# Altium project FSAEWheelDaughterboard.PrjPcb
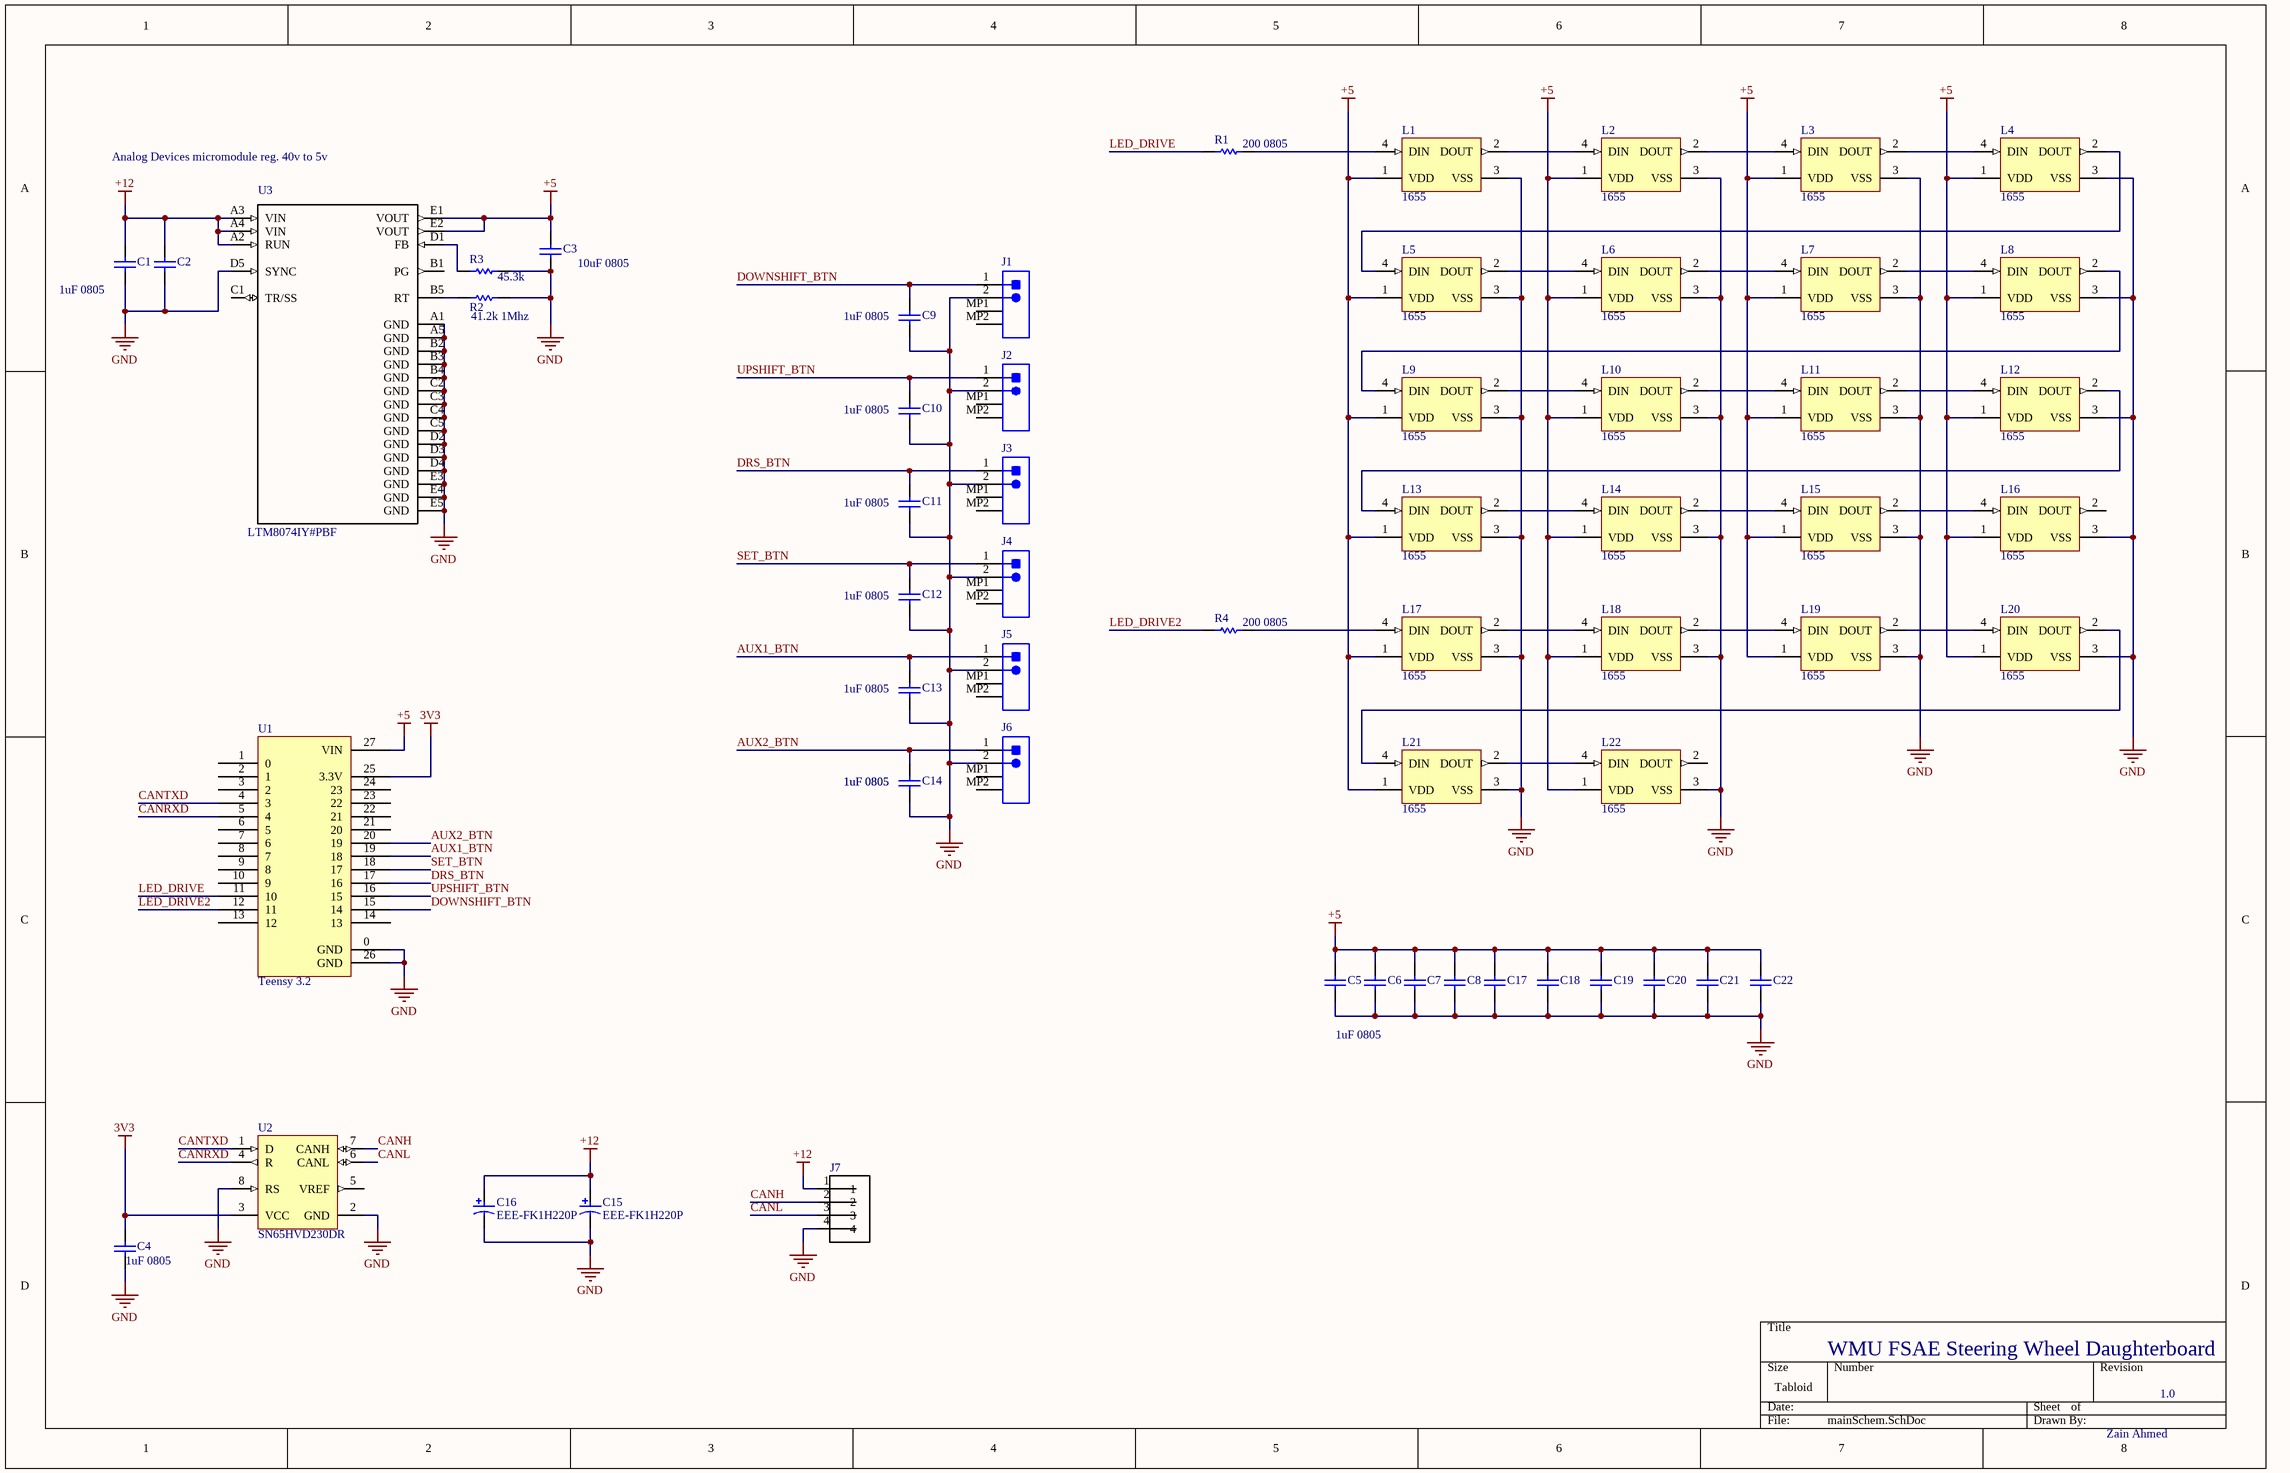
[diagram p0: mainSchem.SchDoc]
1 sheet, 58 parts. Net scope: global (net labels, ports and power ports of the same name join across sheets).
Board file: mainPCB.PcbDoc

## Sheet mainSchem.SchDoc
size Tabloid

### Parts
C1  GRM216R61E105KA12D  [CAPC2013X70X45NL10T25]  (value not drawn)
C2  GRM216R61E105KA12D  [CAPC2013X70X45NL10T25]  (value not drawn)
C3  GRM21BR61C106KE15L  [CAPC2013X135X50LL10T20]  (value not drawn)
C4  GRM216R61E105KA12D  [CAPC2013X70X45NL10T25]  (value not drawn)
C5  GRM216R61E105KA12D  [CAPC2013X70X45NL10T25]  (value not drawn)
C6  GRM216R61E105KA12D  [CAPC2013X70X45NL10T25]  (value not drawn)
C7  GRM216R61E105KA12D  [CAPC2013X70X45NL10T25]  (value not drawn)
C8  GRM216R61E105KA12D  [CAPC2013X70X45NL10T25]  (value not drawn)
C9  GRM216R61E105KA12D  [CAPC2013X70X45NL10T25]  (value not drawn)
C10  GRM216R61E105KA12D  [CAPC2013X70X45NL10T25]  (value not drawn)
C11  GRM216R61E105KA12D  [CAPC2013X70X45NL10T25]  (value not drawn)
C12  GRM216R61E105KA12D  [CAPC2013X70X45NL10T25]  (value not drawn)
C13  GRM216R61E105KA12D  [CAPC2013X70X45NL10T25]  (value not drawn)
C14  GRM216R61E105KA12D  [CAPC2013X70X45NL10T25]  (value not drawn)
C15  EEE-FK1H220P  [PNSC-EEE-FK1H220P_L]
C16  EEE-FK1H220P  [PNSC-EEE-FK1H220P_L]
C17  GRM216R61E105KA12D  [CAPC2013X70X45NL10T25]  (value not drawn)
C18  GRM216R61E105KA12D  [CAPC2013X70X45NL10T25]  (value not drawn)
C19  GRM216R61E105KA12D  [CAPC2013X70X45NL10T25]  (value not drawn)
C20  GRM216R61E105KA12D  [CAPC2013X70X45NL10T25]  (value not drawn)
C21  GRM216R61E105KA12D  [CAPC2013X70X45NL10T25]  (value not drawn)
C22  GRM216R61E105KA12D  [CAPC2013X70X45NL10T25]  (value not drawn)
J1  B2B-PH-SM4-TB(LF)(SN)  [JST-B2B-PH-SM4-TB-2_V]  (value not drawn)
J2  B2B-PH-SM4-TB(LF)(SN)  [JST-B2B-PH-SM4-TB-2_V]  (value not drawn)
J3  B2B-PH-SM4-TB(LF)(SN)  [JST-B2B-PH-SM4-TB-2_V]  (value not drawn)
J4  B2B-PH-SM4-TB(LF)(SN)  [JST-B2B-PH-SM4-TB-2_V]  (value not drawn)
J5  B2B-PH-SM4-TB(LF)(SN)  [JST-B2B-PH-SM4-TB-2_V]  (value not drawn)
J6  B2B-PH-SM4-TB(LF)(SN)  [JST-B2B-PH-SM4-TB-2_V]  (value not drawn)
J7  B4B-PH-SM4-TB  [*JST_B4B-PH-SM4-TB]  (value not drawn)
L1  1655  [ADA-RGB-1655_V]
L2  1655  [ADA-RGB-1655_V]
L3  1655  [ADA-RGB-1655_V]
L4  1655  [ADA-RGB-1655_V]
L5  1655  [ADA-RGB-1655_V]
L6  1655  [ADA-RGB-1655_V]
L7  1655  [ADA-RGB-1655_V]
L8  1655  [ADA-RGB-1655_V]
L9  1655  [ADA-RGB-1655_V]
L10  1655  [ADA-RGB-1655_V]
L11  1655  [ADA-RGB-1655_V]
L12  1655  [ADA-RGB-1655_V]
L13  1655  [ADA-RGB-1655_V]
L14  1655  [ADA-RGB-1655_V]
L15  1655  [ADA-RGB-1655_V]
L16  1655  [ADA-RGB-1655_V]
L17  1655  [ADA-RGB-1655_V]
L18  1655  [ADA-RGB-1655_V]
L19  1655  [ADA-RGB-1655_V]
L20  1655  [ADA-RGB-1655_V]
L21  1655  [ADA-RGB-1655_V]
L22  1655  [ADA-RGB-1655_V]
R1  ERA6AEB201V  [RESC2013X60X40NL20T25]  (value not drawn)
R2  ERJ-6ENF4122V  [RESC2013X70X40LL20T20]  (value not drawn)
R3  ERJ-6ENF4532V  [RESC2013X70X40ML20T20]  (value not drawn)
R4  ERA6AEB201V  [RESC2013X60X40NL20T25]  (value not drawn)
U1  Teensy 3.2  [Teensy3_2]
U2  SN65HVD230DR  [D0008A_L]
U3  LTM8074IY#PBF  [*BGA25C65P5X5_400X400X198N_LTM8074IY#PBF(Primary)]

### Nets
3V3: C4.1 U1.25(3.3V) U2.3(VCC)
+5: C3.1 C5.1 C6.1 C7.1 C8.1 C17.1 C18.1 C19.1 C20.1 C21.1 C22.1 L1.1(VDD) L2.1(VDD) L3.1(VDD) L4.1(VDD) L5.1(VDD) L6.1(VDD) L7.1(VDD) L8.1(VDD) L9.1(VDD) L10.1(VDD) L11.1(VDD) L12.1(VDD) L13.1(VDD) L14.1(VDD) L15.1(VDD) L16.1(VDD) L17.1(VDD) L18.1(VDD) L19.1(VDD) L20.1(VDD) L21.1(VDD) L22.1(VDD) U1.27(VIN) U3.E1(VOUT) U3.E2(VOUT)
+12: C1.1 C2.1 C15.1 C16.1 J7.1 U3.A2(RUN) U3.A3(VIN) U3.A4(VIN)
GND: C1.2 C2.2 C3.2 C4.2 C5.2 C6.2 C7.2 C8.2 C9.2 C10.2 C11.2 C12.2 C13.2 C14.2 C15.2 C16.2 C17.2 C18.2 C19.2 C20.2 C21.2 C22.2 J1.2 J2.2 J3.2 J4.2 J5.2 J6.2 J7.4 L1.3(VSS) L2.3(VSS) L3.3(VSS) L4.3(VSS) L5.3(VSS) L6.3(VSS) L7.3(VSS) L8.3(VSS) L9.3(VSS) L10.3(VSS) L11.3(VSS) L12.3(VSS) L13.3(VSS) L14.3(VSS) L15.3(VSS) L16.3(VSS) L17.3(VSS) L18.3(VSS) L19.3(VSS) L20.3(VSS) L21.3(VSS) L22.3(VSS) R2.2 R3.2 U1.0(GND) U1.26(GND) U2.2(GND) U2.8(RS) U3.A1(GND) U3.A5(GND) U3.B2(GND) U3.B3(GND) U3.B4(GND) U3.C2(GND) U3.C3(GND) U3.C4(GND) U3.C5(GND) U3.D2(GND) U3.D3(GND) U3.D4(GND) U3.D5(SYNC) U3.E3(GND) U3.E4(GND) U3.E5(GND)
AUX1_BTN: C13.1 J5.1 U1.19(18)
AUX2_BTN: C14.1 J6.1 U1.20(19)
CANH: J7.2 U2.7(CANH)
CANL: J7.3 U2.6(CANL)
CANRXD: U1.5(4) U2.4(R)
CANTXD: U1.4(3) U2.1(D)
DOWNSHIFT_BTN: C9.1 J1.1 U1.15(14)
DRS_BTN: C11.1 J3.1 U1.17(16)
LED_DRIVE: R1.1 U1.11(10)
LED_DRIVE2: R4.1 U1.12(11)
SET_BTN: C12.1 J4.1 U1.18(17)
UPSHIFT_BTN: C10.1 J2.1 U1.16(15)
NetL1_2: L1.2(DOUT) L2.4(DIN)
NetL1_4: L1.4(DIN) R1.2
NetL2_2: L2.2(DOUT) L3.4(DIN)
NetL3_2: L3.2(DOUT) L4.4(DIN)
NetL4_2: L4.2(DOUT) L5.4(DIN)
NetL5_2: L5.2(DOUT) L6.4(DIN)
NetL6_2: L6.2(DOUT) L7.4(DIN)
NetL7_2: L7.2(DOUT) L8.4(DIN)
NetL8_2: L8.2(DOUT) L9.4(DIN)
NetL9_2: L9.2(DOUT) L10.4(DIN)
NetL10_2: L10.2(DOUT) L11.4(DIN)
NetL11_2: L11.2(DOUT) L12.4(DIN)
NetL12_2: L12.2(DOUT) L13.4(DIN)
NetL13_2: L13.2(DOUT) L14.4(DIN)
NetL14_2: L14.2(DOUT) L15.4(DIN)
NetL15_2: L15.2(DOUT) L16.4(DIN)
NetL17_2: L17.2(DOUT) L18.4(DIN)
NetL17_4: L17.4(DIN) R4.2
NetL18_2: L18.2(DOUT) L19.4(DIN)
NetL19_2: L19.2(DOUT) L20.4(DIN)
NetL20_2: L20.2(DOUT) L21.4(DIN)
NetL21_2: L21.2(DOUT) L22.4(DIN)
NetR2_1: R2.1 U3.B5(RT)
NetR3_1: R3.1 U3.D1(FB)

Not connected (* = marked no-connect by the designer): J1 MP1 MP2; J2 MP1 MP2; J3 MP1 MP2; J4 MP1 MP2; J5 MP1 MP2; J6 MP1 MP2; L16 2(DOUT); L22 2(DOUT); U1 1(0) 2(1) 3(2) 6(5) 7(6) 8(7) 9(8) 10(9) 13(12) 14(13) 21(20) 22(21) 23(22) 24(23); U2 5(VREF); U3 B1(PG) C1(TR/SS)

### Notes on the sheet
- Analog Devices micromodule reg. 40v to 5v
- (near R1) 200 0805
- (near C1) 1uF 0805
- (near R3) 45.3k
- (near C3) 10uF 0805
- (near R2) 41.2k 1Mhz
- (near C9) 1uF 0805
- (near C10) 1uF 0805
- (near C11) 1uF 0805
- (near C12) 1uF 0805
- (near R4) 200 0805
- (near C13) 1uF 0805
- (near C14) 1uF 0805
- 1uF 0805
- (near C4) 1uF 0805
- WMU FSAE Steering Wheel Daughterboard
- 1.0
- Zain Ahmed

### Library data of the parts
C1 C2 C4-C14 C17-C22 = CMP-2007-00957-1: Manufacturer: Murata; Part Number: GRM216R61E105KA12D
C3 = CMP-2007-03453-1: Manufacturer: Murata; Part Number: GRM21BR61C106KE15L
C15 C16 = CMP-2000-06209-1: Cap Aluminum Lytic, 22 uF, +/- 20%, 6.3 to 100 V, -55 to 105 degC, 2-Pin SMD, RoHS, Tape and Reel; Manufacturer: Panasonic; Capacitance: 22µF; Rated Voltage: 50V; Lifetime@Temperature: 2000Hrs@105°C; Ripple Current: 165mA; Impedance: 0.88O; Type: Can; Operating Temp Range: -55to+105°C; Package Reference: EEE-FK1H220P; Case Size/Dimension: Ø6.3x5.8mm; Manufacturer URL: http://www.panasonic.com/; Datasheet URL: http://www.mouser.com/ds/2/315/ABA0000CE120-68386.pdf; Mounting Technology: SurfaceMount; Datasheet Version: 03/2014; Package Description: 2-Pin Aluminum Electrolytic Capacitor, Base 6.6 x 6.6 mm, Height 6.10 mm; Operating Temp-Max: 105°C; Series: FK
J1-J6 = CMP-2000-05163-1: Male Header, Pitch 2 mm, 1 x 2 Position, Height 6.6 mm, RoHS, Tape and Reel; Manufacturer: JST; No of Positions: 2; Style/Orientation: StraightHeader/Plug; Pitch: 2mm; Datasheet URL: https://ciiva.com/datasheet-click-26894756?src=ciiva&sig=90099765; Termination: Crimp; Manufacturer URL: http://www.jst.com/home2.html; Type: ShroudedHeader; Datasheet Version: Dec-12
J7 = B4B-PH-SM4-TB: Connector Header Surface Mount 4 position 0.079 _2.00mm_; MF: JST Sales; SnapEDA_Link: https://www.snapeda.com/parts/B4B-PH-SM4-TB/JST%20Sales%20America%20Inc./view-part/48901/?ref=snap; Availability: Unavailable; Package: None; Price: None; MP: B4B-PH-SM4-TB; Value: *
L1-L22 = CMP-2000-05026-1: Intelligent Control LED Integrated Light Source, 3.5 to 5.3 V, -25 to 80 degC, 4-Pin SMD, RoHS, Tape and Reel; Manufacturer: Adafruit-Industries-LLC; Number of LEDs: 10; Configuration: Discrete; Utilized LED: WS2812(5050); Color: Red,Green,Blue(RGB); Datasheet URL: http://datasheet.octopart.com/ADA1655-Adafruit-Industries-datasheet-32028139.pdf; Series: Neopixel; Interface: -; Package Description: 4-Pin Surface Mount Device, Body 5 x 5 mm; Category: Optoelectronics; Controller Type: -; Package Reference: 1655; Manufacturer URL: https://www.adafruit.com/; Mounting Type: SurfaceMount; Datasheet Version: May-13; Size / Dimension: 5.00mmLx5.00mmW; Family: Addressable,Specialty
R1 R4 = CMP-2001-00608-1: Manufacturer: Panasonic; Part Number: ERA6AEB201V
R2 = CMP-2001-00174-1: Manufacturer: Panasonic; Part Number: ERJ-6ENF4122V
R3 = CMP-2001-00193-1: Manufacturer: Panasonic; Part Number: ERJ-6ENF4532V
U2 = CMP-0315-00015-2: 3.3V CAN Transceiver with Standby Mode, 17 mA, -40 to 85 degC, 8-pin SOIC (D), Green (RoHS & no Sb/Br); Manufacturer: Texas Instruments; Rating: Catalog; Transient Pulse Protection(V): -25 to 25; Receivers Per Package: 1; ICC(Max)(mA): 17; Supply Voltage(s)(V): 3.3; Low Power Mode: Standby; Mounting Technology: Surface Mount; PackageReference: D0008A; Footprint: PCA82C250; ComponentLink1URL: http://www.ti.com/general/docs/lit/getliterature.tsp?genericPartNumber=SN65HVD230&fileType=pdf; Code_JEDEC: MS-012AA; ComponentLink1Description: Datasheet; Eco-Plan: Green (RoHS & no Sb/Br); PartNumber: SN65HVD230DR; PackageDescription: 8-Pin Plastic Small Outline Integrated Circuit, 4.9 x 3.9 mm, Pitch 1.27 mm Pitch; Isolated: No; DatasheetVersion: SLOS346K; PackageVersion: revM, Jun-2011; SubFamily: CAN; Drivers Per Package: 1
U3 = LTM8074IY#PBF: 40Vin, 0.7A Step Dwn uModule Reg; MF: Analog Devices; SnapEDA_Link: https://www.snapeda.com/parts/LTM8074IY%23PBF/Analog%20Devices/view-part/4335081/?ref=snap; Availability: Unavailable; Package: BGA -25 Analog Devices; Price: None; MP: LTM8074IY#PBF; Value: *